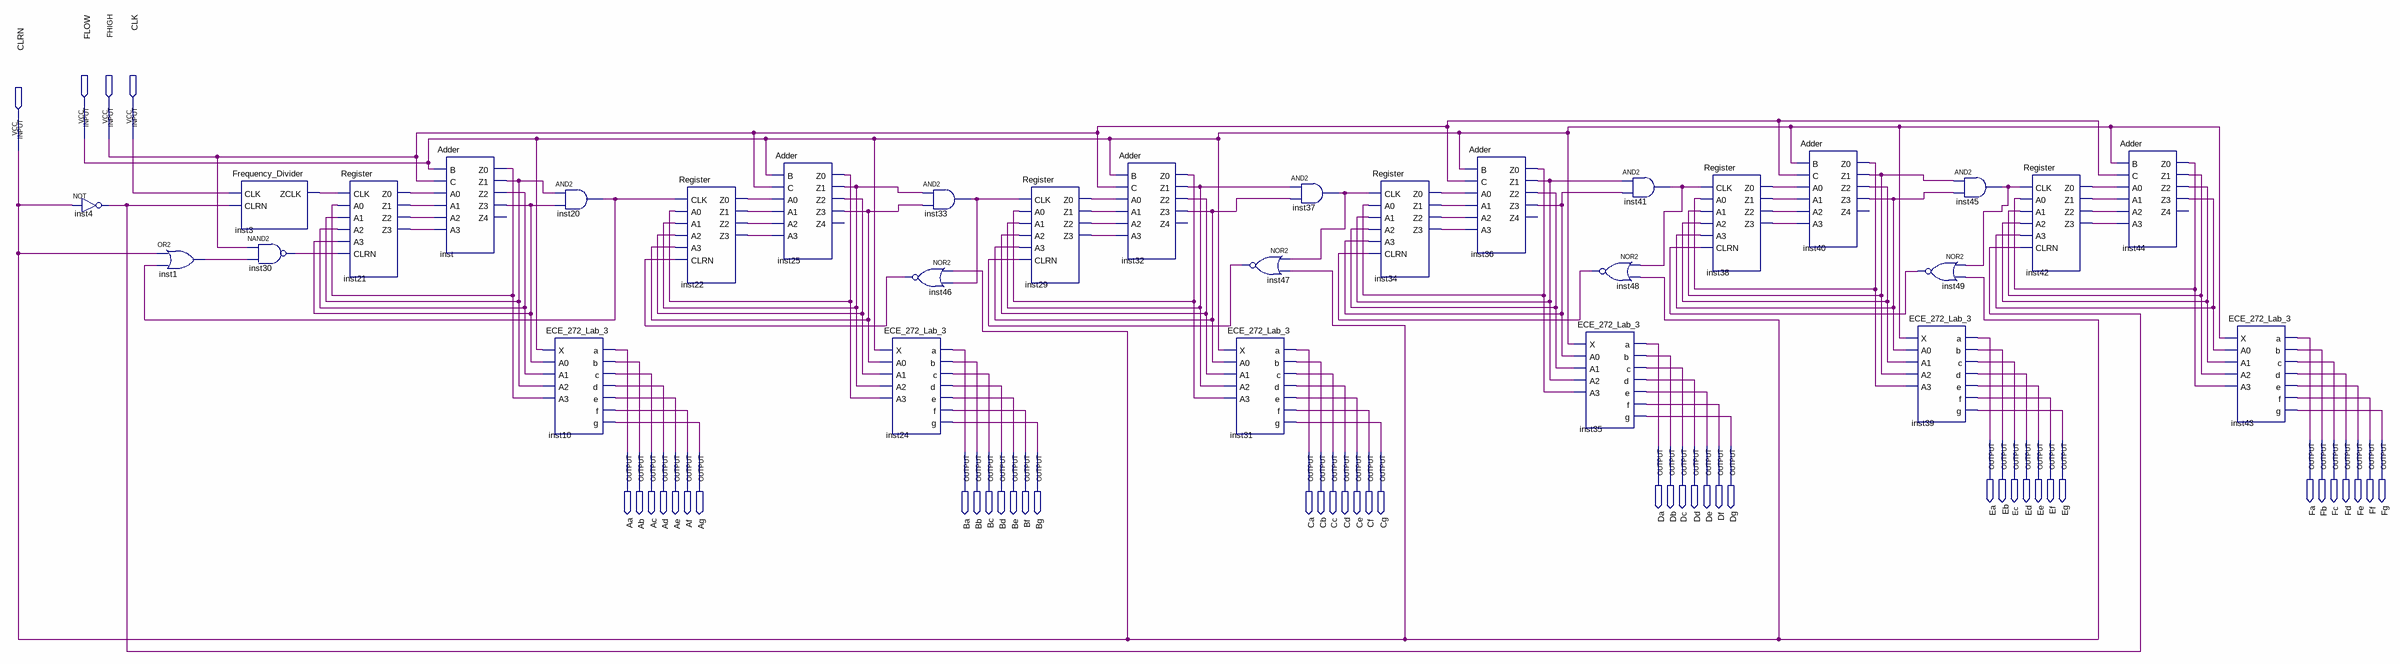
[diagram p0: schematic sheet]
// Quartus schematic ECE_272_Lab_4.bdf as structural Verilog: 31 symbols, 46 pins
module ECE_272_Lab_4 (
  input  FLOW,
  input  FHIGH,
  input  CLK,
  input  CLRN,
  output Ea,
  output Eb,
  output Ec,
  output Ed,
  output Ee,
  output Ef,
  output Eg,
  output Fa,
  output Fb,
  output Fc,
  output Fd,
  output Fe,
  output Ff,
  output Fg,
  output Da,
  output Db,
  output Dc,
  output Dd,
  output De,
  output Df,
  output Dg,
  output Aa,
  output Ab,
  output Ac,
  output Ad,
  output Ae,
  output Af,
  output Ag,
  output Ba,
  output Bb,
  output Bc,
  output Bd,
  output Be,
  output Bf,
  output Bg,
  output Ca,
  output Cb,
  output Cc,
  output Cd,
  output Ce,
  output Cf,
  output Cg
);

  wire inst1_out, inst3_zclk, inst4_out, inst20_out, inst21_z0, inst21_z1, inst21_z2, inst21_z3, inst22_z0,
       inst22_z1, inst22_z2, inst22_z3, inst25_z0, inst25_z1, inst25_z2, inst25_z3, inst29_z0, inst29_z1,
       inst29_z2, inst29_z3, inst30_out, inst32_z0, inst32_z1, inst32_z2, inst32_z3, inst33_out, inst34_z0,
       inst34_z1, inst34_z2, inst34_z3, inst36_z0, inst36_z1, inst36_z2, inst36_z3, inst37_out, inst38_z0,
       inst38_z1, inst38_z2, inst38_z3, inst40_z0, inst40_z1, inst40_z2, inst40_z3, inst41_out, inst42_z0,
       inst42_z1, inst42_z2, inst42_z3, inst44_z0, inst44_z1, inst44_z2, inst44_z3, inst45_out, inst46_out,
       inst47_out, inst48_out, inst49_out, inst_z0, inst_z1, inst_z2, inst_z3;

  not inst4 (inst4_out, CLRN);
  or inst1 (inst1_out, CLRN, inst20_out);
  Frequency_Divider inst3 (.CLK(CLK), .CLRN(inst4_out), .ZCLK(inst3_zclk));
  nand inst30 (inst30_out, FHIGH, inst1_out);
  Register inst21 (
    .CLK(inst3_zclk), .A0(inst_z0), .A1(inst_z1), .A2(inst_z2), .A3(inst_z3), .CLRN(inst30_out),
    .Z0(inst21_z0), .Z1(inst21_z1), .Z2(inst21_z2), .Z3(inst21_z3));
  Adder inst (
    .B(FLOW), .C(FHIGH), .A0(inst21_z0), .A1(inst21_z1), .A2(inst21_z2), .A3(inst21_z3), .Z0(inst_z0),
    .Z1(inst_z1), .Z2(inst_z2), .Z3(inst_z3));  // open: Z4
  and inst20 (inst20_out, inst_z1, inst_z3);
  ECE_272_Lab_3 inst10 (
    .X(FLOW), .A0(inst_z3), .A1(inst_z2), .A2(inst_z1), .A3(inst_z0), .a(Aa), .b(Ab), .c(Ac), .d(Ad), .e(Ae),
    .f(Af), .g(Ag));
  Register inst22 (
    .CLK(inst20_out), .A0(inst25_z0), .A1(inst25_z1), .A2(inst25_z2), .A3(inst25_z3), .CLRN(inst46_out),
    .Z0(inst22_z0), .Z1(inst22_z1), .Z2(inst22_z2), .Z3(inst22_z3));
  Adder inst25 (
    .B(FLOW), .C(FHIGH), .A0(inst22_z0), .A1(inst22_z1), .A2(inst22_z2), .A3(inst22_z3), .Z0(inst25_z0),
    .Z1(inst25_z1), .Z2(inst25_z2), .Z3(inst25_z3));  // open: Z4
  ECE_272_Lab_3 inst24 (
    .X(FLOW), .A0(inst25_z3), .A1(inst25_z2), .A2(inst25_z1), .A3(inst25_z0), .a(Ba), .b(Bb), .c(Bc), .d(Bd),
    .e(Be), .f(Bf), .g(Bg));
  and inst33 (inst33_out, inst25_z1, inst25_z3);
  nor inst46 (inst46_out, CLRN, inst33_out);
  Register inst29 (
    .CLK(inst33_out), .A0(inst32_z0), .A1(inst32_z1), .A2(inst32_z2), .A3(inst32_z3), .CLRN(inst47_out),
    .Z0(inst29_z0), .Z1(inst29_z1), .Z2(inst29_z2), .Z3(inst29_z3));
  Adder inst32 (
    .B(FLOW), .C(FHIGH), .A0(inst29_z0), .A1(inst29_z1), .A2(inst29_z2), .A3(inst29_z3), .Z0(inst32_z0),
    .Z1(inst32_z1), .Z2(inst32_z2), .Z3(inst32_z3));  // open: Z4
  ECE_272_Lab_3 inst31 (
    .X(FLOW), .A0(inst32_z3), .A1(inst32_z2), .A2(inst32_z1), .A3(inst32_z0), .a(Ca), .b(Cb), .c(Cc), .d(Cd),
    .e(Ce), .f(Cf), .g(Cg));
  nor inst47 (inst47_out, inst37_out, CLRN);
  and inst37 (inst37_out, inst32_z1, inst32_z3);
  Register inst34 (
    .CLK(inst37_out), .A0(inst36_z0), .A1(inst36_z1), .A2(inst36_z2), .A3(inst36_z3), .CLRN(inst48_out),
    .Z0(inst34_z0), .Z1(inst34_z1), .Z2(inst34_z2), .Z3(inst34_z3));
  Adder inst36 (
    .B(FLOW), .C(FHIGH), .A0(inst34_z0), .A1(inst34_z1), .A2(inst34_z2), .A3(inst34_z3), .Z0(inst36_z0),
    .Z1(inst36_z1), .Z2(inst36_z2), .Z3(inst36_z3));  // open: Z4
  nor inst48 (inst48_out, inst41_out, CLRN);
  ECE_272_Lab_3 inst35 (
    .X(FLOW), .A0(inst36_z3), .A1(inst36_z2), .A2(inst36_z1), .A3(inst36_z0), .a(Da), .b(Db), .c(Dc), .d(Dd),
    .e(De), .f(Df), .g(Dg));
  and inst41 (inst41_out, inst36_z1, inst36_z3);
  Register inst38 (
    .CLK(inst41_out), .A0(inst40_z0), .A1(inst40_z1), .A2(inst40_z2), .A3(inst40_z3), .CLRN(inst49_out),
    .Z0(inst38_z0), .Z1(inst38_z1), .Z2(inst38_z2), .Z3(inst38_z3));
  Adder inst40 (
    .B(FLOW), .C(FHIGH), .A0(inst38_z0), .A1(inst38_z1), .A2(inst38_z2), .A3(inst38_z3), .Z0(inst40_z0),
    .Z1(inst40_z1), .Z2(inst40_z2), .Z3(inst40_z3));  // open: Z4
  ECE_272_Lab_3 inst39 (
    .X(FLOW), .A0(inst40_z3), .A1(inst40_z2), .A2(inst40_z1), .A3(inst40_z0), .a(Ea), .b(Eb), .c(Ec), .d(Ed),
    .e(Ee), .f(Ef), .g(Eg));
  and inst45 (inst45_out, inst40_z1, inst40_z3);
  nor inst49 (inst49_out, inst45_out, CLRN);
  Register inst42 (
    .CLK(inst45_out), .A0(inst44_z0), .A1(inst44_z1), .A2(inst44_z2), .A3(inst44_z3), .CLRN(inst4_out),
    .Z0(inst42_z0), .Z1(inst42_z1), .Z2(inst42_z2), .Z3(inst42_z3));
  Adder inst44 (
    .B(FLOW), .C(FHIGH), .A0(inst42_z0), .A1(inst42_z1), .A2(inst42_z2), .A3(inst42_z3), .Z0(inst44_z0),
    .Z1(inst44_z1), .Z2(inst44_z2), .Z3(inst44_z3));  // open: Z4
  ECE_272_Lab_3 inst43 (
    .X(FLOW), .A0(inst44_z3), .A1(inst44_z2), .A2(inst44_z1), .A3(inst44_z0), .a(Fa), .b(Fb), .c(Fc), .d(Fd),
    .e(Fe), .f(Ff), .g(Fg));
endmodule
